# Altium schematic sheet killswitch.SchDoc
size A
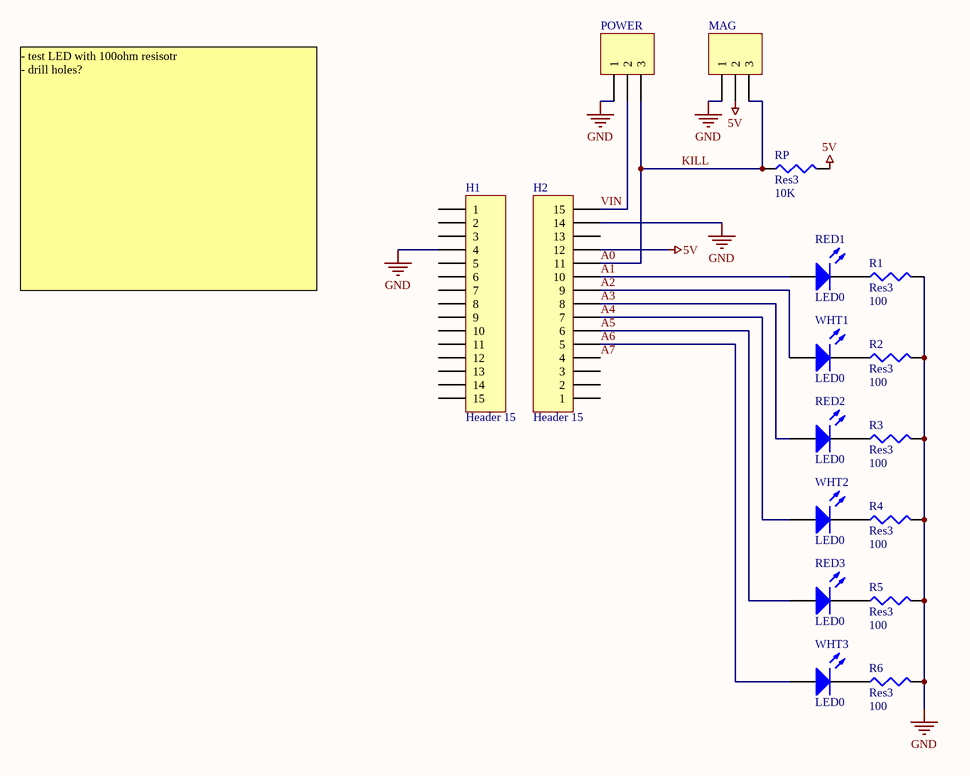
[diagram p0: killswitch.SchDoc]

## Parts
H1  Header 15  [HDR1X15]
H2  Header 15  [HDR1X15]
MAG  Header 3  [HDR1X3]  (value not drawn)
POWER  Header 3  [HDR1X3]  (value not drawn)
R1  Res3  value 100  [0805_RES]
R2  Res3  value 100  [0805_RES]
R3  Res3  value 100  [0805_RES]
R4  Res3  value 100  [0805_RES]
R5  Res3  value 100  [0805_RES]
R6  Res3  value 100  [0805_RES]
RED1  LED0  [cree_led]
RED2  LED0  [cree_led]
RED3  LED0  [cree_led]
RP  Res3  value 10K  [0805_RES]
WHT1  LED0  [cree_led]
WHT2  LED0  [cree_led]
WHT3  LED0  [cree_led]

## Nets
5V: H2.12 MAG.2 RP.2
GND: H1.4 H2.14 MAG.1 POWER.1 R1.2 R2.2 R3.2 R4.2 R5.2 R6.2
A0: H2.11 MAG.3 POWER.3 RP.1  [also labelled KILL]
A1: H2.10 RED1.1(A)
A2: H2.9 WHT1.1(A)
A3: H2.8 RED2.1(A)
A4: H2.7 WHT2.1(A)
A5: H2.6 RED3.1(A)
A6: H2.5 WHT3.1(A)
A7: H2.4
VIN: H2.15 POWER.2
NetR1_1: R1.1 RED1.2(K)
NetR2_1: R2.1 WHT1.2(K)
NetR3_1: R3.1 RED2.2(K)
NetR4_1: R4.1 WHT2.2(K)
NetR5_1: R5.1 RED3.2(K)
NetR6_1: R6.1 WHT3.2(K)

Not connected (* = marked no-connect by the designer): H1 1 2 3 5 6 7 8 9 10 11 12 13 14 15; H2 1 2 3 13

## Notes on the sheet
- - test LED with 100ohm resisotr
  - drill holes?

## Library data of the parts
H1 H2 = Header 15: Header, 15-Pin; LatestRevisionDate: 17-Jul-2002; LatestRevisionNote: Re-released for DXP Platform.; Publisher: Altium Limited
MAG POWER = Header 3: Header, 3-Pin; LatestRevisionDate: 17-Jul-2002; LatestRevisionNote: Re-released for DXP Platform.; Publisher: Altium Limited
R1-R6 RP = Res3: Resistor; Published: 8-Jun-2000; LatestRevisionDate: 04-Mar-2005; LatestRevisionNote: PCB Footprint replaced.; PackageReference: J1-0603; Publisher: Altium Limited
RED1-RED3 WHT1-WHT3 = LED0: Typical INFRARED GaAs LED; Published: 8-Jun-2000; LatestRevisionDate: 08-Jul-2005; LatestRevisionNote: Mech Layer 1 removed.; PackageReference: LED-0; Publisher: Altium Limited